# Altium schematic sheet Sheet1.SchDoc
size A4
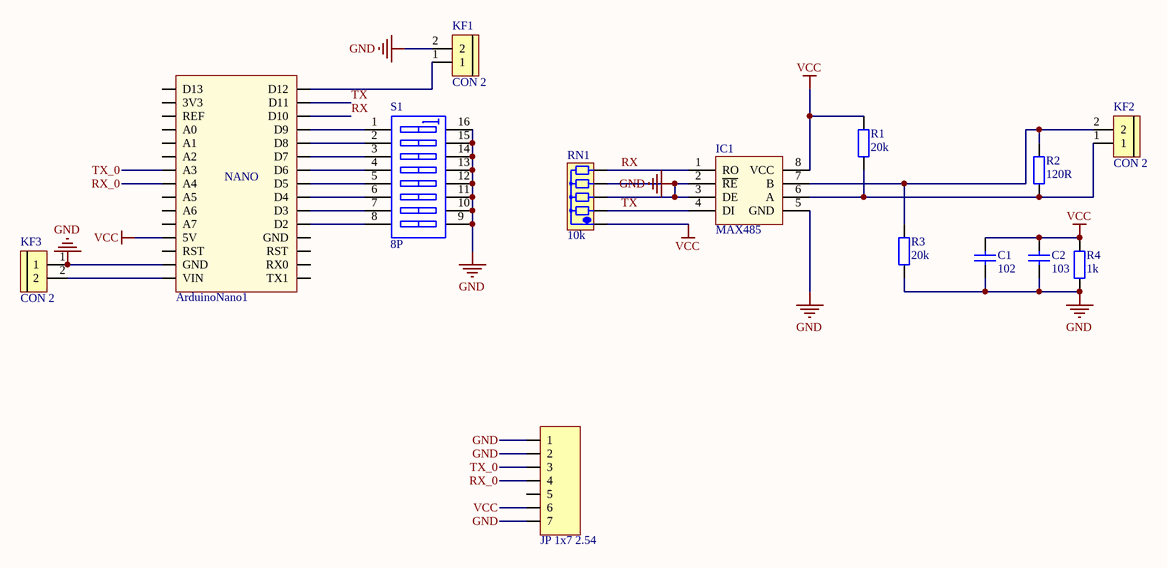
[diagram p0: Sheet1.SchDoc]

## Parts
ArduinoNano1  Arduino Nano  [Arduino Nano]  (value not drawn)
C1  102  [tu gom]
C2  103  [tu gom]
IC1  MAX485  [DIP8/W0.3]
JP1  JP 1x7 2.54  [JP 1x7 CT]
KF1  CON 2  [Con 2 KF301 5.08]
KF2  CON 2  [Con 2 KF301 5.08]
KF3  CON 2  [Con 2 KF301 5.08]
R1  20k  [tro vach 1/4w]
R2  120R  [tro vach 1/4w]
R3  20k  [tro vach 1/4w]
R4  1k  [tro vach 1/4w]
RN1  10k  [RN4]
S1  8P  [SW-DIP8]

## Nets
GND: ArduinoNano1.GND C1.2 C2.2 IC1.2(~{RE}) IC1.3(DE) IC1.5(GND) JP1.1 JP1.2 JP1.7 KF1.2 KF3.1 R3.1 R4.1 RN1.3 RN1.4 S1.9(B8) S1.10(B7) S1.11(B6) S1.12(B5) S1.13(B4) S1.14(B3) S1.15(B2) S1.16(B1)
VCC: ArduinoNano1.5V C1.1 C2.1 IC1.8(VCC) JP1.6 R1.2 R4.2 RN1.1
RX: ArduinoNano1.D10 IC1.1(RO) RN1.5
RX_0: ArduinoNano1.A4 JP1.4
TX: ArduinoNano1.D11 IC1.4(DI) RN1.2
TX_0: ArduinoNano1.A3 JP1.3
NetArduinoNano1_D2: ArduinoNano1.D2 S1.8(A8)
NetArduinoNano1_D3: ArduinoNano1.D3 S1.7(A7)
NetArduinoNano1_D4: ArduinoNano1.D4 S1.6(A6)
NetArduinoNano1_D5: ArduinoNano1.D5 S1.5(A5)
NetArduinoNano1_D6: ArduinoNano1.D6 S1.4(A4)
NetArduinoNano1_D7: ArduinoNano1.D7 S1.3(A3)
NetArduinoNano1_D8: ArduinoNano1.D8 S1.2(A2)
NetArduinoNano1_D9: ArduinoNano1.D9 S1.1(A1)
NetArduinoNano1_D12: ArduinoNano1.D12 KF1.1
NetArduinoNano1_VIN: ArduinoNano1.VIN KF3.2
NetIC1_6: IC1.6(A) KF2.1 R1.1 R2.1
NetIC1_7: IC1.7(B) KF2.2 R2.2 R3.2

Not connected (* = marked no-connect by the designer): ArduinoNano1 3V3 A0 A1 A2 A5 A6 A7 D13 REF RST RX0 TX1; JP1 5

## Notes on the sheet
- (in symbol Arduino Nano) NANO

## Library data of the parts
ArduinoNano1 = Arduino Nano: Value: Cau 1A
C1 = Tu gom 102 50V: Cắm; Don_Vi: Con; So_Chan: 2; Ten_Linh_Kien: Tụ gốm 102 1nF 50V; Ma_Hang: MH004763; Chung_Loai: Cắm; Kieu_Chan: *
C2 = Tu gom 103 50V: Cắm; So_Chan: 2; Ten_Linh_Kien: Tụ gốm 103 10nF 50V; Don_Vi: Con; Ma_Hang: MH000936; Chung_Loai: Cắm; Kieu_Chan: *
IC1 = MAX485: RS232 - RS485 (Same sn75176)
JP1 = JP 1x7 2.54 Cai Thang: Cắm; Ten_Linh_Kien: Jump Đơn Cái 2.54MM 1x20P Thẳng; Don_Vi: Con; Ma_Hang: MH004006; Ghi_Chu: *; Kieu_Chan: *; Chung_Loai: Cắm
KF1-KF3 = CON 2 KF301: Cắm; Ma_Hang: MH000987; Ten_Linh_Kien: CON 2 KF301-2P 5.08MM Xanh Dương; Chung_Loai: Cắm; Ghi_Chu: *; Kieu_Chan: *; Don_Vi: Con
R1 R3 = Tro Vach 1/4W 5% 20k: Cắm; Don_Vi: Con; So_Chan: 2; Ten_Linh_Kien: Trở Vạch 1/4w 5% 20k; Ma_Hang: MH007297; Chung_Loai: Cắm; Kieu_Chan: *
R2 = Tro Vach 1/4W 5% 120R: Cắm; Don_Vi: Con; So_Chan: 2; Ten_Linh_Kien: Trở Vạch 1/4W 5% 120R; Ma_Hang: MH007388; Chung_Loai: Cắm; Kieu_Chan: *
R4 = Tro Vach 1/4W 5% 1k: Cắm; Don_Vi: Con; So_Chan: 2; Ten_Linh_Kien: Trở Vạch 1/4w 5% 1k; Ma_Hang: MH007390; Chung_Loai: Cắm; Kieu_Chan: *
RN1 = RN4: Resistor 4 (thanh); Value: Tro thanh 4K7
S1 = Cong Tac Bits 8P: Cắm; Ten_Linh_Kien: Switch Số 8P ( Công Tắc Bit 8P); Don_Vi: Con; Ma_Hang: MH000971; Kieu_Chan: *; Ghi_Chu: *; Chung_Loai: Cắm